# EAGLE design Transmit module (EAGLE 6.4)

## Sheet 1 of 2: power
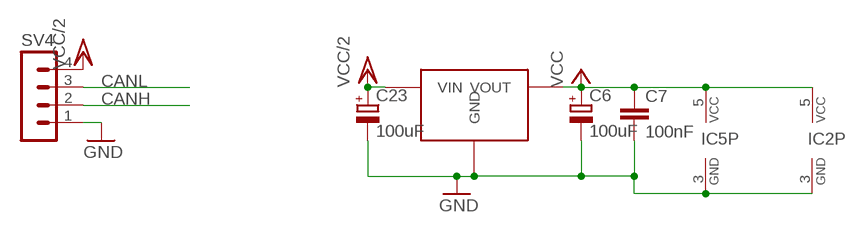
[diagram p0: schematic, sheet 1]

### Parts
C6  100uF  CPOL-EU153CLV-0605  [153CLV-0605]
C7  100nF  C-EUC0805  [C0805]
C23  100uF  CPOL-EU153CLV-0605  [153CLV-0605]
IC2  74AHCT1G14DBV  [SOT23-5]
IC5  74AHCT1G14DBV  [SOT23-5]
SV4  MA04-1  [MA04-1]
U$2  TS2940  [TO-252]

### Nets
CANH: SV4.2 ; also sheet 2
CANL: SV4.3 ; also sheet 2
GND: C6.- C7.2 C23.- IC2.3(GND) IC5.3(GND) SV4.1 U$2.GND ; also sheet 2
VCC: C6.+ C7.1 IC2.5(VCC) IC5.5(VCC) U$2.VOUT ; also sheet 2
VCC/2: C23.+ SV4.4 U$2.VIN ; also sheet 2

## Sheet 2 of 2: logic
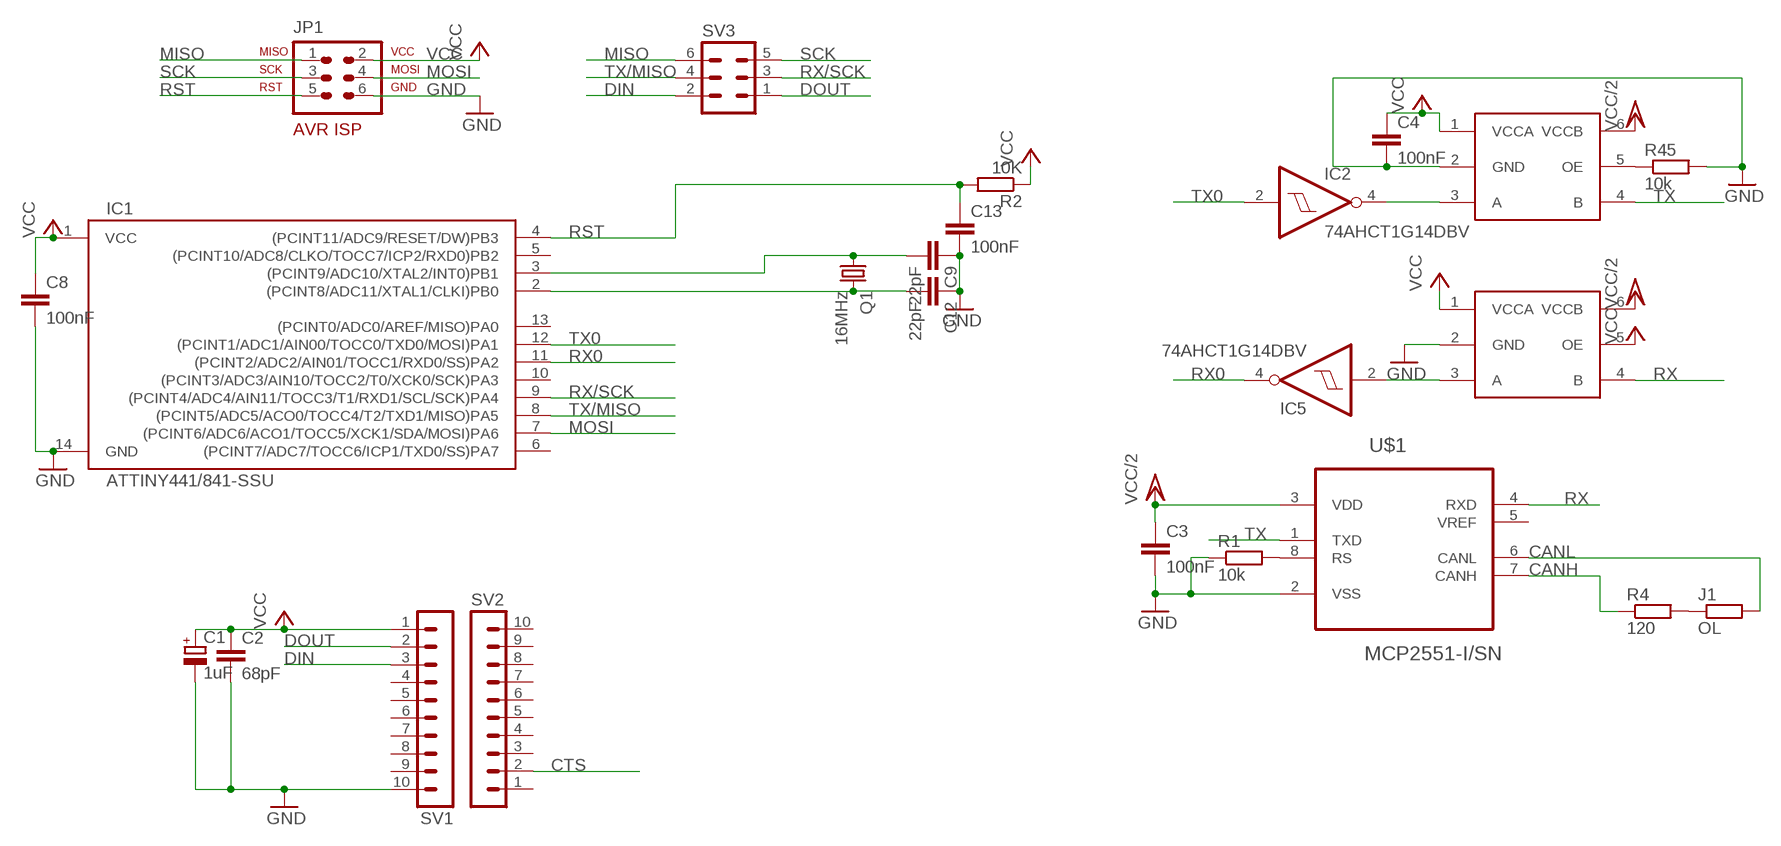
[diagram p1: schematic, sheet 2]

### Parts
C1  1uF  CPOL-EU153CLV-0505  [153CLV-0505]
C2  68pF  C-EUC0805  [C0805]
C3  100nF  C-EUC0805  [C0805]
C4  100nF  C-EUC0805  [C0805]
C8  100nF  C-EUC0805  [C0805]
C9  22pF  C-EUC0805  [C0805]
C12  22pF  C-EUC0805  [C0805]
C13  100nF  C-EUC0805  [C0805]
IC1  ATTINY441/841-SSU  [SOIC14N]
J1  OL  R-EU_R0805  [R0805]
JP1  AVR-ISP-6VERT  [AVR-ISP-6]
Q1  16MHz  CRYSTALHC49UP  [HC49UP]
R1  10k  R-EU_M0805  [M0805]
R2  10K  R-EU_R0805  [R0805]
R4  120  R-EU_R0805  [R0805]
R45  10k  R-EU_R0805  [R0805]
SV1  MA10-1  [MA10-1]
SV2  MA10-1  [MA10-1]
SV3  MA03-2  [MA03-2]
U$1  MCP2551-I/SN  [SOIC127P600X175-8N]
U$3  TXB0101  [TSOT23-6_DDC]
U$4  TXB0101  [TSOT23-6_DDC]

### Nets
CANH: R4.1 U$1.7(CANH) ; also sheet 1
CANL: J1.2 U$1.6(CANL) ; also sheet 1
CTS: SV2.2
DIN: SV1.3 SV3.2
DOUT: SV1.2 SV3.1
GND: C1.- C2.2 C3.2 C4.2 C8.2 C9.1 C12.1 C13.2 IC1.14(GND) JP1.6 R1.1 R45.2 SV1.10 U$1.2(VSS) U$3.2(GND) U$4.2(GND) ; also sheet 1
MISO: JP1.1 SV3.6
MOSI: IC1.7((PCINT6/ADC6/ACO1/TOCC5/XCK1/SDA/MOSI)PA6) JP1.4
N$1: R1.2 U$1.8(RS)
N$3: R45.1 U$3.5(OE)
N$10: C9.2 IC1.3((PCINT9/ADC10/XTAL2/INT0)PB1) Q1.1
N$11: C12.2 IC1.2((PCINT8/ADC11/XTAL1/CLKI)PB0) Q1.2
N$31: IC2.4(O) U$3.3(A)
N$34: IC5.2(I) U$4.3(A)
N$35: J1.1 R4.2
RST: C13.1 IC1.4((PCINT11/ADC9/RESET/DW)PB3) JP1.5 R2.2
RX: U$1.4(RXD) U$4.4(B)
RX0: IC1.11((PCINT2/ADC2/AIN01/TOCC1/RXD0/SS)PA2) IC5.4(O)
RX/SCK: IC1.9((PCINT4/ADC4/AIN11/TOCC3/T1/RXD1/SCL/SCK)PA4) SV3.3
SCK: JP1.3 SV3.5
TX: U$1.1(TXD) U$3.4(B)
TX0: IC1.12((PCINT1/ADC1/AIN00/TOCC0/TXD0/MOSI)PA1) IC2.2(I)
TX/MISO: IC1.8((PCINT5/ADC5/ACO0/TOCC4/T2/TXD1/MISO)PA5) SV3.4
VCC: C1.+ C2.1 C4.1 C8.1 IC1.1(VCC) JP1.2 R2.1 SV1.1 U$3.1(VCCA) U$4.1(VCCA) U$4.5(OE) ; also sheet 1
VCC/2: C3.1 U$1.3(VDD) U$3.6(VCCB) U$4.6(VCCB) ; also sheet 1
Unconnected: IC1.5((PCINT10/ADC8/CLKO/TOCC7/ICP2/RXD0)PB2) IC1.6((PCINT7/ADC7/TOCC6/ICP1/TXD0/SS)PA7) IC1.10((PCINT3/ADC3/AIN10/TOCC2/T0/XCK0/SCK)PA3) IC1.13((PCINT0/ADC0/AREF/MISO)PA0) SV1.4 SV1.5 SV1.6 SV1.7 SV1.8 SV1.9 SV2.1 SV2.3 SV2.4 SV2.5 SV2.6 SV2.7 SV2.8 SV2.9 SV2.10 U$1.5(VREF)

## Library data of the parts
C1 = rcl:CPOL-EU: POLARIZED CAPACITOR, European symbol; FARNELL: 1714751
C2 = rcl:C-EU: CAPACITOR, European symbol; FARNELL: 2497040
C3 C4 C7-C9 C12 C13 = rcl:C-EU: CAPACITOR, European symbol
C6 C23 = rcl:CPOL-EU: POLARIZED CAPACITOR, European symbol; FARNELL: 1244406RL
IC1 = bt_avr:ATTINY441/841: ATtiny441, ATtiny841 AVR Microcontroller The high-performance Atmel picoPower 8-bit AVR RISC-based microcontroller combines 4KB ISP flash memory, 512-Byte EEPROM, 128B SRAM, 12 general purpose I/O lines, 32 general purpose working registers, an 8-bit timer/counter with two PWM channels, two 16-bit timer/counters with two PWM channels, internal and external interrupts, an 12-channel 10-bit A/D converter, 2 On-chip analog comparators, 2 full duplex USARTs with Start Frame wake up from power down, master/slave SPI serial interface, slave I2C serial interface, programmable gain stage (1x, 20x, and 100x) for 12 differential ADC channel pairs, programmable watchdog timer with internal oscillator, internal calibrated oscillator, and four software selectable power saving modes. The device operates between 1.7-5.5 volts. datasheet.pdf <http://www.atmel.com/Images/Atmel-8495-8-bit-AVR-Microcontrollers-ATtiny441-ATtiny841_Datasheet.pdf>; FARNELL: 2396716
IC2 IC5 = 74xx-little-us:74*1G14: Single Schmitt-Trigger Inverter Gate
J1 R2 R4 R45 = rcl:R-EU_: RESISTOR, European symbol
JP1 = avr-7:AVR-ISP-6: AVR ISP-6 Serial Programming Header
Q1 = crystal:CRYSTAL: CRYSTAL; OC_FARNELL: unknown; OC_NEWARK: unknown
R1 = resistor:R-EU_: RESISTOR, European symbol
SV1 SV2 = con-lstb:MA10-1: PIN HEADER; OC_FARNELL: unknown; OC_NEWARK: unknown
SV3 = con-lstb:MA03-2: PIN HEADER; OC_FARNELL: unknown; OC_NEWARK: unknown
SV4 = con-lstb:MA04-1: PIN HEADER; OC_FARNELL: unknown; OC_NEWARK: unknown
U$1 = mcp:MCP2551-I/SN: High-Speed CAN Transceiver; MPN: MCP2551-I/SN; OC_FARNELL: 9758569; OC_NEWARK: 69K7604; PACKAGE: SOIC-8; SUPPLIER: Microchip
U$2 = LDO:TS2940
U$3 U$4 = texas:TXB0101

## Board
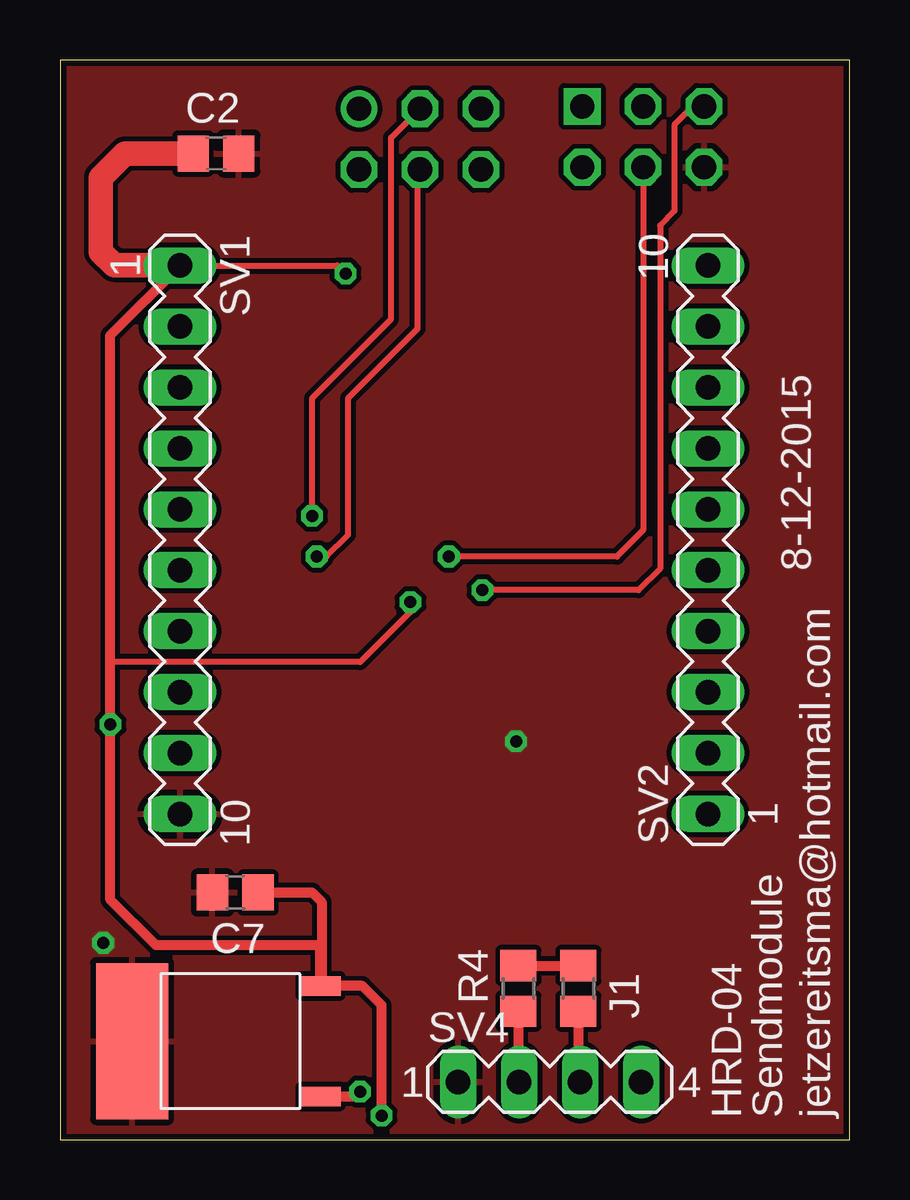
[diagram p2: board, top side]
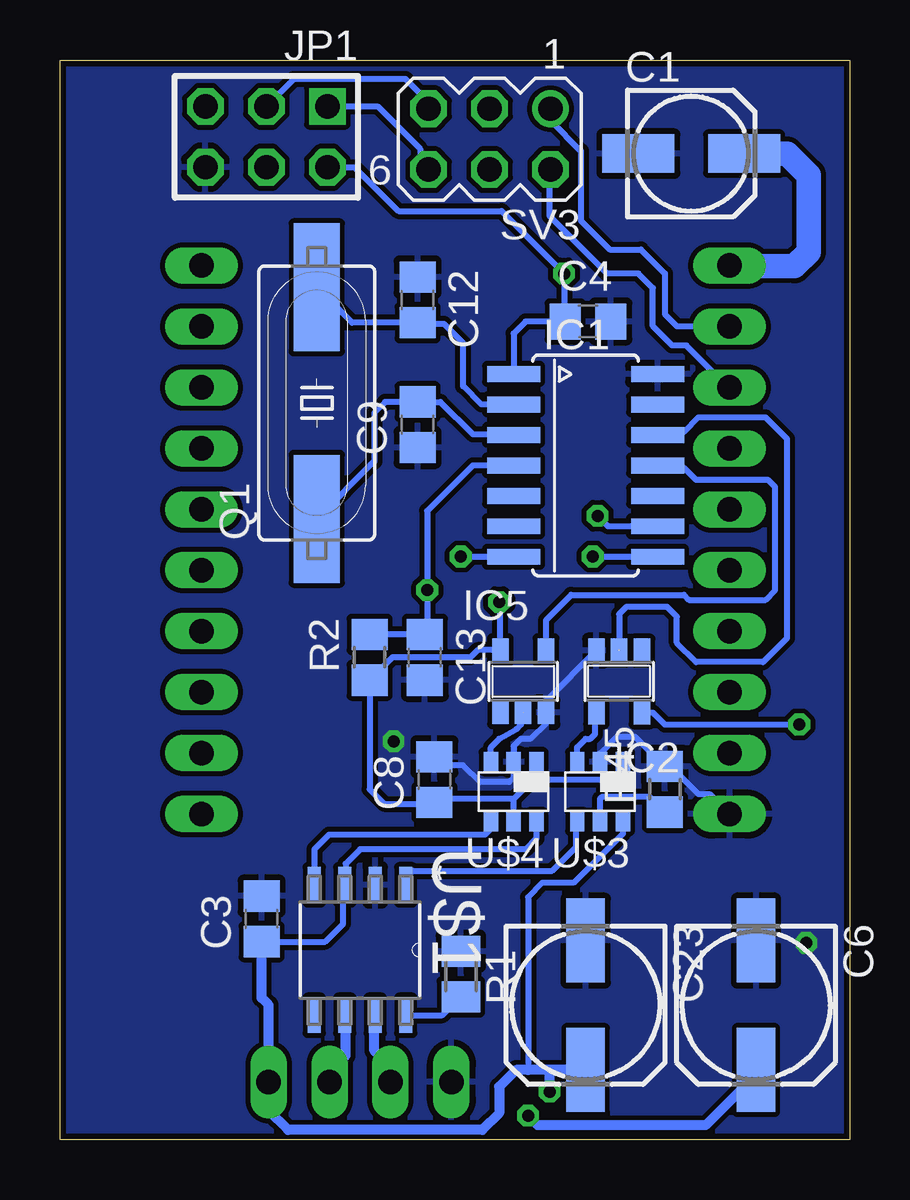
[diagram p3: board, bottom side, seen from below]

Size 32.9 x 45 mm. Coordinates in mm from the lower left corner, seen from the top.
Outline: 0,0 32.9,0 32.9,45 0,45 0,0
Copper layers (1*16): Top 0.035mm / dielectric 1.5mm / Bottom 0.035mm
Design rules "default *": minimum track width 10mil, minimum drill 24mil, track to track 8mil, track to pad 8mil, pad to pad 8mil, via to via 8mil, smd to smd 8mil, copper to edge 10mil, drill to drill 8mil, minimum pad ring 10mil, minimum via ring 8mil, stop-mask expansion 4mil, vias tented up to drill 0mil, thermal gap 10mil

### Footprints (pad centres in the part's own frame; a part is rotated, then mirrored left to right if it is on the bottom)
153CLV-0505 = smd 3 x 1.6: + 2.2,0; - -2.2,0
C0805 = smd 1.3 x 1.5: 1 -0.95,0; 2 0.95,0
153CLV-0605 = smd 3.5 x 1.6: + 2.7,0; - -2.7,0
SOIC14N = smd 0.66 x 2.2: 1 -3.81,-3; 2 -2.54,-3; 3 -1.27,-3; 4 0,-3; 5 1.27,-3; 6 2.54,-3; 7 3.81,-3; 8 3.81,3; 9 2.54,3; 10 1.27,3; 11 0,3; 12 -1.27,3; 13 -2.54,3; 14 -3.81,3
SOT23-5 = smd 0.69 x 0.99: 1 -0.95,-1.29; 2 0,-1.29; 3 0.95,-1.29; 4 0.95,1.3; 5 -0.95,1.3
R0805 = smd 1.3 x 1.5: 1 -0.95,0; 2 0.95,0
AVR-ISP-6 = drill 1.016 square: 1 -2.54,-1.27 | drill 1.016 octagon: 2 -2.54,1.27; 3 0,-1.27; 4 0,1.27; 5 2.54,-1.27; 6 2.54,1.27
HC49UP = smd 5.334 x 1.93: 1 -4.826,0; 2 4.826,0
M0805 = smd 1.3 x 1.6: 1 -0.95,0; 2 0.95,0
MA10-1 = drill 1.016 long: 1 -11.43,0; 2 -8.89,0; 3 -6.35,0; 4 -3.81,0; 5 -1.27,0; 6 1.27,0; 7 3.81,0; 8 6.35,0; 9 8.89,0; 10 11.43,0
MA03-2 = drill 1.016: 1 -2.54,-1.27 | drill 1.016 octagon: 2 -2.54,1.27; 3 0,-1.27; 4 0,1.27; 5 2.54,-1.27; 6 2.54,1.27
MA04-1 = drill 1.016 long: 1 -3.81,0; 2 -1.27,0; 3 1.27,0; 4 3.81,0
SOIC127P600X175-8N = smd 1.473 x 0.559: 1 -2.718,1.905; 2 -2.718,0.635; 3 -2.718,-0.635; 4 -2.718,-1.905; 5 2.718,-1.905; 6 2.718,-0.635; 7 2.718,0.635; 8 2.718,1.905
TO-252 = smd 6.5 x 3: GND 0,4.2 | smd 0.813 x 1.676: VIN -2.3,-3.65; VOUT 2.3,-3.65
TSOT23-6_DDC = smd 0.6 x 0.8: 1 -0.95,-1.25; 2 0,-1.25; 3 0.95,-1.25; 4 0.95,1.25; 5 0,1.25; 6 -0.95,1.25

### Placement (x,y rotation side)
C1  6.6,41.1 0 bottom
C2  6.5,41.1 0 top
C3  24.5,9.2 90 bottom
C4  10.9,34.1 0 bottom
C6  3.9,5.6 270 bottom
C7  7.3,10.3 180 top
C8  17.3,15 90 bottom
C9  18,29.8 90 bottom
C12  18,35 270 bottom
C13  17.7,20.1 270 bottom
C23  11,5.6 270 bottom
IC1  11,28.1 270 bottom
IC2  9.6,19.1 180 bottom
IC5  13.6,19.1 0 bottom
J1  21.6,6.3 270 top
JP1  24.3,41.8 180 bottom
Q1  22.2,30.7 90 bottom
R1  16.2,6.9 270 bottom
R2  20,20.1 90 bottom
R4  19.1,6.3 90 top
R45  7.7,14.6 90 bottom
SV1  5,25 270 top
SV2  27,25 90 top
SV3  15,41.7 180 bottom
SV4  20.4,2.4 0 top
U$1  20.4,7.9 270 bottom
U$2  7.2,4.1 90 top
U$3  10.4,14.5 180 bottom
U$4  14,14.5 180 bottom

### Tracks (layer width: path | path; a pad name or v marks a point on that pad's centre or on a via)
CANH
  Top 0.406: R4.1 19.1,2.33 SV4.2
  Bottom 0.406: SV4.2 19.13,3.03 19.8,3.7 19.8,5.15 U$1.7
CANL
  Top 0.406: J1.2 21.6,2.37 SV4.3
  Bottom 0.406: SV4.3 21.67,2.83 21,3.5 21,5.15 U$1.6
DIN
  Bottom 0.254: SV1.3 5.05,31.35 6.8,33.1 7.4,33.1 8.2,33.9 8.2,35.5 8.8,36.1 10.1,36.1 12.5,38.5 12.5,40.39 SV3.2
DOUT
  Bottom 0.254: SV3.1 12.46,42.46 11.2,41.2 11.2,38.3 10,37.1 8.7,37.1 7.7,36.1 7.7,34.4 7.2,33.9 SV1.2
GND  (via drill 0.5 pad 0.81)
  Bottom 0.254: U$3.2 10.4,16.1 9.7,16.8 8.95,16.8 R45.2 7.45,15.55 6.3,14.4 5.83,14.4 SV1.10 | IC2.3 12.65,18.29 IC5.3 12.65,17.35 13.3,16.7 13.7,16.7 14,16.4 U$4.2 14,15.1 14.2,14.9 15.4,14.9 16.1,15.6 16.95,15.6 C8.2
  other vias: 19,16.6 1.8,8.2
  pour Bottom: 0,0 32.9,0 32.9,45 0,45
  pour Top: 0,0 32.9,0 32.9,45 0,45
MISO
  Bottom 0.254: JP1.1 19.67,43.07 17.9,41.3 17.9,40.79 SV3.6
MOSI  (via drill 0.5 pad 0.81)
  Top 0.254: JP1.4 24.3,25.4 23.2,24.3 v16.2,24.3
  Bottom 0.254: v16.2,24.3 IC1.7
N$1
  Bottom 0.254: U$1.8 16.97,5.18 R1.2
N$3
  Bottom 0.254: U$3.5 10.4,14.2 10.3,14.3 8.35,14.3 R45.1
N$10
  Bottom 0.254: IC1.3 14.03,29.4 15.7,29.4 17.05,30.75 C9.2 19.35,30.75 19.8,30.3 19.8,28.27 Q1.1
N$11
  Bottom 0.254: IC1.2 15.34,30.64 16.1,31.4 16.1,33.2 16.9,34 17.95,34 C12.2 20.72,34.05 Q1.2
N$31
  Bottom 0.254: U$3.3 11.35,16.35 11,16.7 10.8,16.7 10.6,16.9 10.6,17.75 IC2.4
N$34
  Bottom 0.254: U$4.3 14.95,16.35 14.6,16.7 13.9,17.1 13.7,17.3 IC5.2
N$35
  Top 0.406: R4.2 J1.1
RST  (via drill 0.5 pad 0.81)
  Top 0.254: JP1.5 26.37,43.07 25.6,42.3 25.6,38.7 25,38.1 25,23.8 24.1,22.9 v17.6,22.9
  Bottom 0.254: IC1.4 15.7,28.1 17.6,26.2 v17.6,22.9 17.6,21.15 C13.1 R2.2
RX
  Bottom 0.254: U$4.4 14.85,13.05 15.2,12.7 21.7,12.7 22.3,12.1 U$1.4
RX0
  Bottom 0.254: IC5.4 12.65,21.65 11.6,22.7 6.9,22.7 6.7,22.5 3.5,22.5 3.1,22.9 3.1,27.2 3.4,27.5 6.4,27.5 6.9,28 7.9,28 IC1.11
RX/SCK  (via drill 0.5 pad 0.81)
  Top 0.254: v10.5,26 10.5,30.9 13.8,34.2 13.8,41.77 SV3.3
  Bottom 0.254: IC1.9 10.06,25.56 v10.5,26
SCK
  Bottom 0.254: SV3.5 17.54,43.24 18.5,44.2 23.17,44.2 JP1.3
TX
  Bottom 0.254: U$1.1 18.5,10.9 18.2,11.2 12.4,11.2 11.4,12.2 11.4,13.2 U$3.4
TX0
  Bottom 0.254: IC1.12 7.87,29.5 6.9,29.5 6.3,30.1 3.5,30.1 2.6,29.2 2.6,20.9 3.6,19.9 6.4,19.9 7.2,20.7 7.2,21.8 7.6,22.2 9.3,22.2 9.6,21.9 IC2.2
TX/MISO  (via drill 0.5 pad 0.81)
  Top 0.254: v10.7,24.3 11.1,24.3 12,25.2 12,30.9 14.9,33.8 14.9,40.33 SV3.4
  Bottom 0.254: IC1.8 v10.69,24.29 v10.7,24.3
VCC  (via drill 0.5 pad 0.81)
  Top 0.254: SV1.1 11.57,36.43 v11.9,36.1 | v14.6,22.4 14.6,22 12.5,19.9 2.1,19.9
  Top 0.406: C7.1 10.5,10.3 10.9,9.9 10.9,8.1 | 10.9,8.1 10.9,6.45 U$2.VOUT | U$2.VOUT 10.85,8.05 10.9,8.1 | 10.9,8.1 4,8.1 2.1,10 v2.1,17.3 2.1,19.9 2.1,33.53 SV1.1 | v13.4,1 13.4,5.6 12.6,6.4 U$2.VOUT
  Top 1.016: C2.1 2.7,41.1 1.7,40.1 1.7,37 2.25,36.45 4.98,36.45 SV1.1
  Bottom 0.254: IC1.1 14,33.6 13.5,34.1 C4.1 11.9,34.15 v11.9,36.1 14.5,38.7 18.8,38.7 20.63,40.53 JP1.2 | U$3.1 9.45,15.25 9.7,15 12.8,15 13,15.2 | 13,15.2 13,15.7 U$4.1 | U$4.5 14,14.2 | 14,14.2 13,15.2 | 14,14.2 17.15,14.2 C8.1 17.35,14 19.4,14 20,14.6 R2.1 19.05,20.1 15.8,20.1 15.5,20.4 IC5.5 14.55,22.35 v14.6,22.4 | IC2.5 8.2,17.8 7.7,17.3 v2.1,17.3
  Bottom 0.406: C6.+ 3.9,2.7 6,0.6 13,0.6 v13.4,1
  Bottom 1.016: C1.+ 2.6,41.1 1.7,40.2 1.7,37 2.3,36.4 4.97,36.4 SV1.1
VCC/2  (via drill 0.5 pad 0.81)
  Top 0.406: U$2.VIN 12.3,1.8 v12.5,2
  Bottom 0.254: C3.1 21.85,8.25 21.1,9 21.1,10.55 U$1.3 21,10.65 21,11.5 20.4,12.1 13.5,12.1 13.05,12.55 U$4.6 | U$3.6 9.45,12.75 11.5,10.7 12.8,10.7 13.4,10.1 13.4,2.9
  Bottom 0.406: C3.1 24.5,5.9 24.21,5.61 SV4.4 24.2,2.29 24.2,1.2 23.4,0.4 15.3,0.4 14.6,1.1 14.6,2.2 13.9,2.9 13.4,2.9 12.6,2.9 | C23.+ 12.6,2.9 | v12.5,2 12.5,2.8 12.6,2.9

### Text on the board
tNames: 8-12-2015 | HRD-04 | Sendmodule | jetzereitsma@hotmail.com